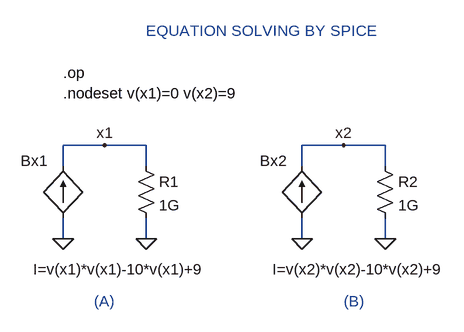
[diagram p0: schematic EQUATION SOLVING BY SPICE.asc]
EQUATION SOLVING BY SPICE.asc, the LTspice schematic file:
Version 4
SHEET 1 880 772
WIRE -64 96 -128 96
WIRE 0 96 -64 96
WIRE 304 96 240 96
WIRE 368 96 304 96
WIRE -128 128 -128 96
WIRE 0 128 0 96
WIRE 240 128 240 96
WIRE 368 128 368 96
WIRE -128 240 -128 208
WIRE 0 240 0 208
WIRE 240 240 240 208
WIRE 368 240 368 208
FLAG -128 240 0
FLAG 0 240 0
FLAG -64 96 x1
FLAG 240 240 0
FLAG 368 240 0
FLAG 304 96 x2
SYMBOL bi -128 208 R180
WINDOW 0 24 88 Left 0
WINDOW 3 -218 -79 Left 0
SYMATTR InstName Bx1
SYMATTR Value I=v(x1)*v(x1)-10*v(x1)+9
SYMBOL res -16 112 R0
SYMATTR InstName R1
SYMATTR Value 1G
SYMBOL bi 240 208 R180
WINDOW 0 24 88 Left 0
WINDOW 3 -218 -79 Left 0
SYMATTR InstName Bx2
SYMATTR Value I=v(x2)*v(x2)-10*v(x2)+9
SYMBOL res 352 112 R0
SYMATTR InstName R2
SYMATTR Value 1G
TEXT -128 -16 Left 0 !.op
TEXT -128 16 Left 0 !.nodeset v(x1)=0 v(x2)=9
TEXT -80 336 Left 0 ;(A)
TEXT 304 336 Left 0 ;(B)
TEXT 0 -80 Left 0 ;EQUATION SOLVING BY SPICE

The netlist it stands for:
* EQUATION SOLVING BY SPICE.asc
Bx1 0 x1 I=v(x1)*v(x1)-10*v(x1)+9
R1 x1 0 1G
Bx2 0 x2 I=v(x2)*v(x2)-10*v(x2)+9
R2 x2 0 1G
.op
.nodeset v(x1)=0 v(x2)=9
* (A)
* (B)
* EQUATION SOLVING BY SPICE
.backanno
.end